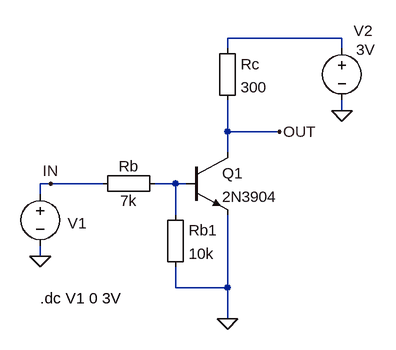
[diagram p0: schematic BT-CE-SWITCH-VCE.asc]
BT-CE-SWITCH-VCE.asc, the LTspice schematic file:
Version 4
SHEET 1 880 680
WIRE 384 -96 208 -96
WIRE 208 -80 208 -96
WIRE 384 -80 384 -96
WIRE 384 16 384 0
WIRE 208 48 208 0
WIRE 288 48 208 48
WIRE 208 80 208 48
WIRE -64 128 -80 128
WIRE 16 128 -64 128
WIRE 128 128 96 128
WIRE 144 128 128 128
WIRE -80 144 -80 128
WIRE 128 176 128 128
WIRE -80 240 -80 224
WIRE 128 288 128 256
WIRE 208 288 208 176
WIRE 208 288 128 288
WIRE 208 336 208 288
FLAG 208 336 0
FLAG -80 240 0
FLAG 384 16 0
FLAG -64 128 IN
FLAG 288 48 OUT
SYMBOL Misc\\EuropeanResistor 192 -96 R0
SYMATTR InstName Rc
SYMATTR Value 300
SYMBOL Misc\\EuropeanResistor 112 112 R90
WINDOW 0 5 56 VBottom 2
WINDOW 3 27 56 VTop 2
SYMATTR InstName Rb
SYMATTR Value 7k
SYMBOL voltage -80 128 R0
WINDOW 3 -4 148 Invisible 2
WINDOW 123 0 0 Left 2
WINDOW 39 0 0 Left 2
WINDOW 0 42 61 Left 2
SYMATTR Value 0
SYMATTR InstName V1
SYMBOL voltage 384 -96 R0
WINDOW 3 22 18 Left 2
WINDOW 123 0 0 Left 2
WINDOW 39 0 0 Left 2
WINDOW 0 18 -11 Left 2
SYMATTR Value 3V
SYMATTR InstName V2
SYMBOL npn 144 80 R0
SYMATTR InstName Q1
SYMATTR Value 2N3904
SYMBOL Misc\\EuropeanResistor 112 160 R0
SYMATTR InstName Rb1
SYMATTR Value 10k
TEXT -80 304 Left 2 !.dc V1 0 3V

The netlist it stands for:
* BT-CE-SWITCH-VCE.asc
Rc N001 OUT 300
Rb N002 IN 7k
V1 IN 0 0
V2 N001 0 3V
Q1 OUT N002 0 0 2N3904
Rb1 N002 0 10k
.model NPN NPN
.model PNP PNP
.lib standard.bjt
.dc V1 0 3V
.backanno
.end